# Altium project usb_keyboard.PrjPcb
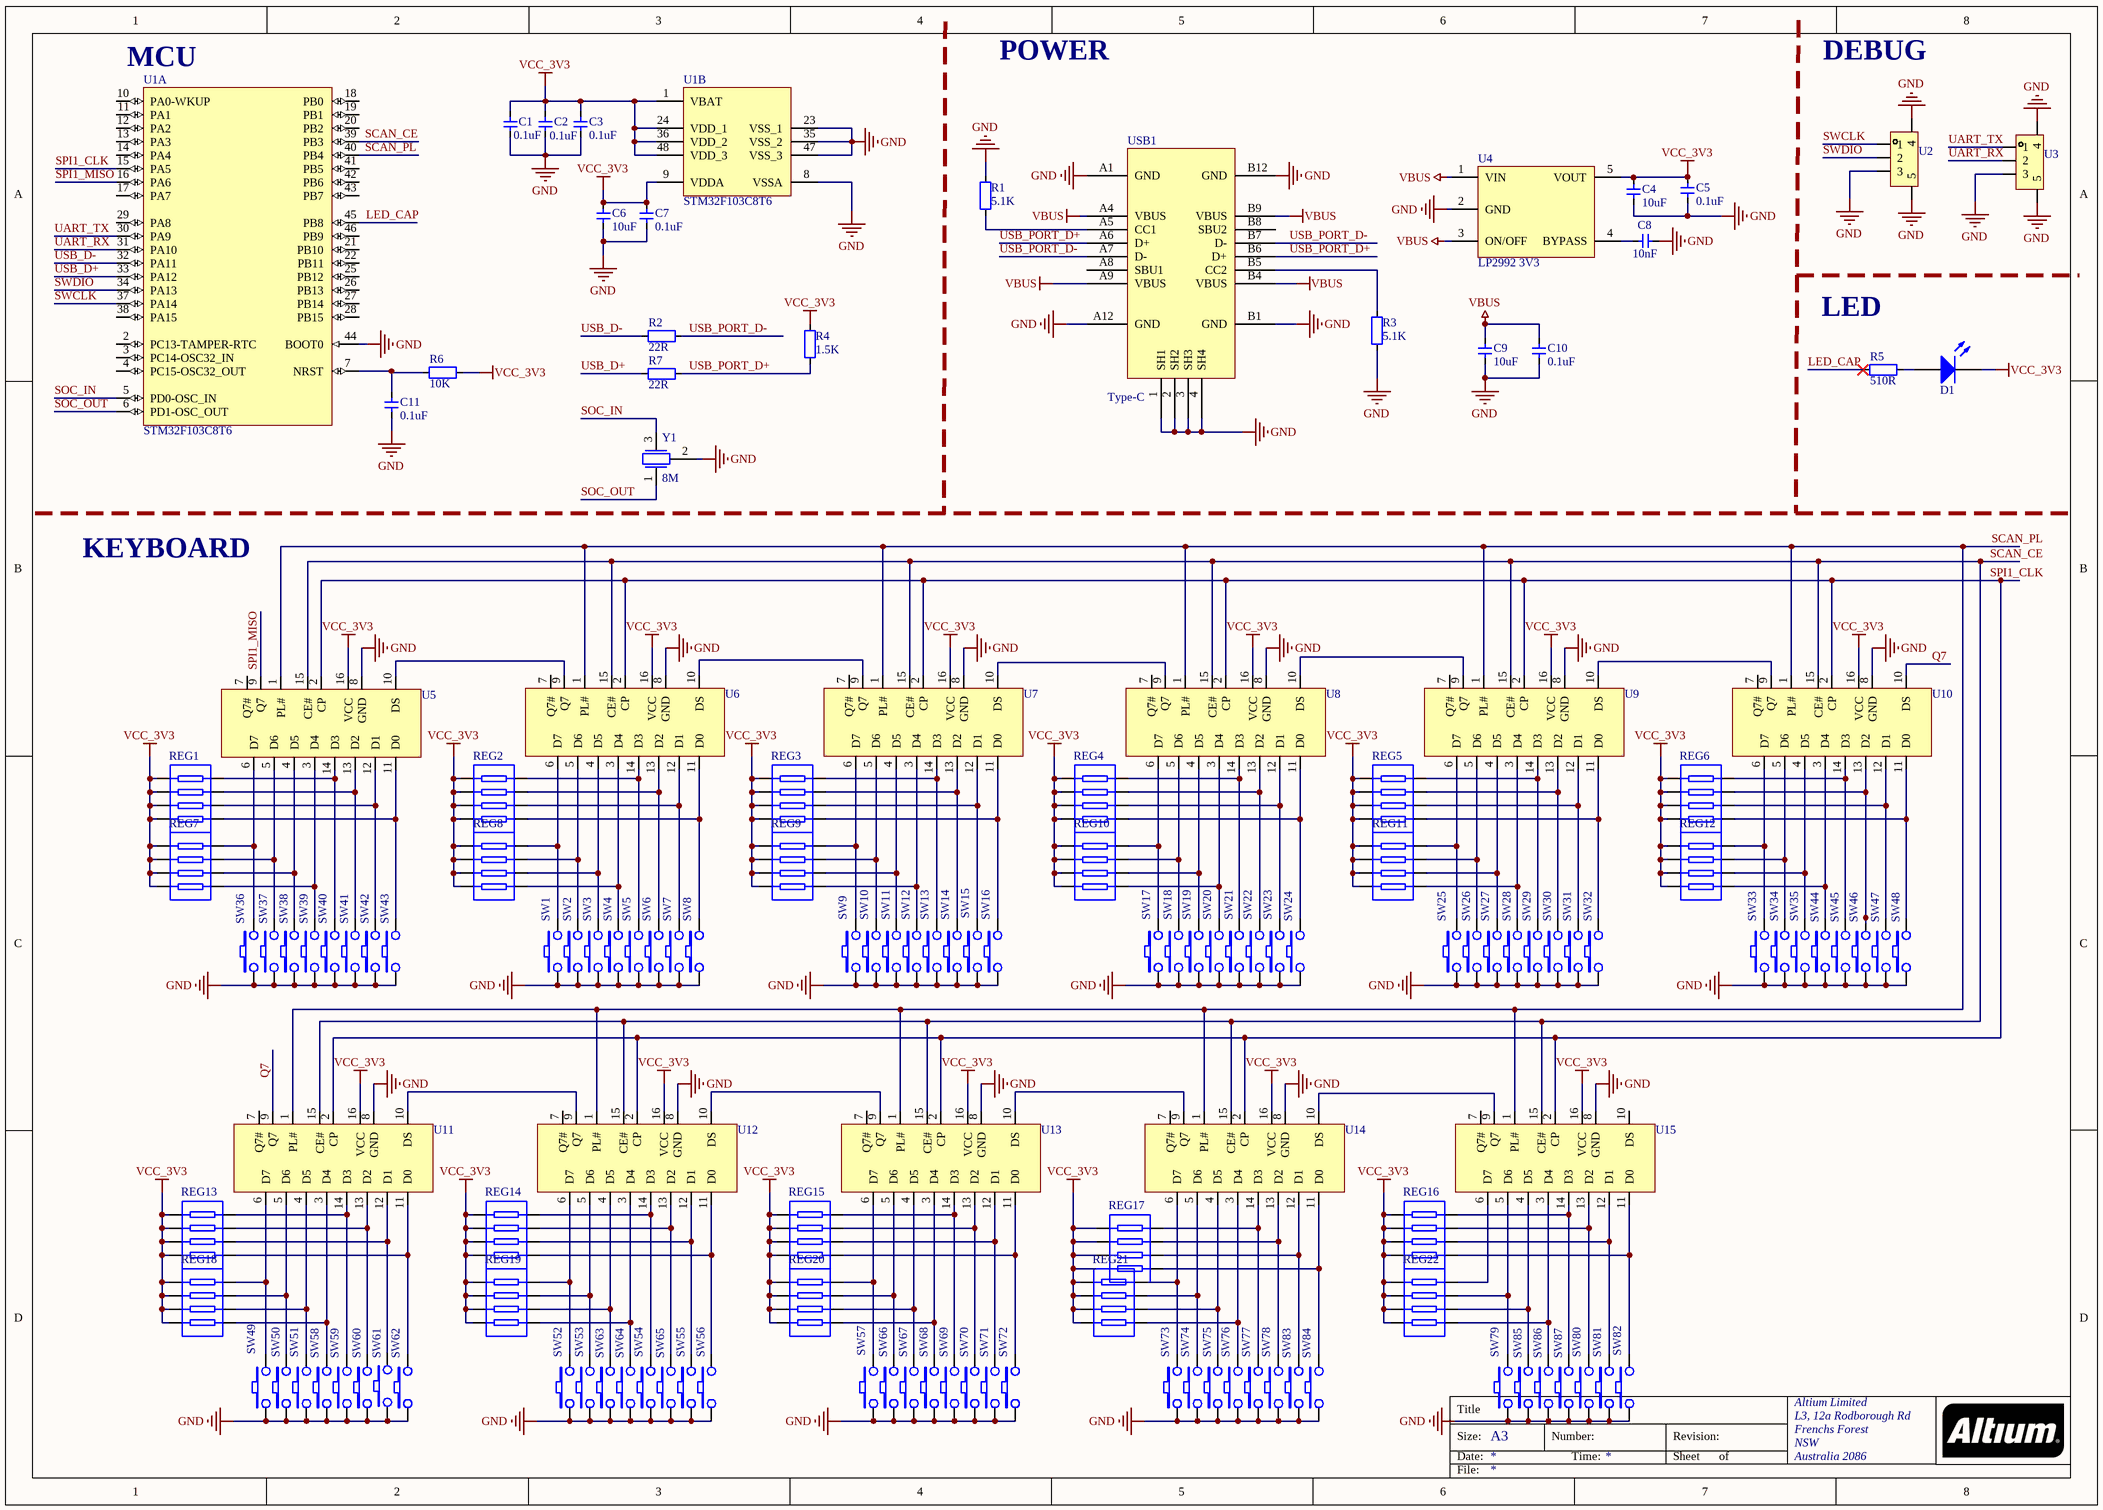
[diagram p0: usb_keyboard.SchDoc]
1 sheet, 145 parts. Net scope: global (net labels, ports and power ports of the same name join across sheets).
Board file: usb_keyboard.PcbDoc

## Sheet usb_keyboard.SchDoc
size A3; Organization: Altium Limited; Address1: L3, 12a Rodborough Rd; Address2: Frenchs Forest; Address3: NSW; Address4: Australia 2086

### Parts
C1  0.1uF  [CAP_0603]
C2  0.1uF  [CAP_0603]
C3  0.1uF  [CAP_0603]
C4  10uF  [CAP_0603]
C5  0.1uF  [CAP_0603]
C6  10uF  [CAP_0603]
C7  0.1uF  [CAP_0603]
C8  10nF  [CAP_0603]
C9  10uF  [CAP_0603]
C10  0.1uF  [CAP_0603]
C11  0.1uF  [CAP_0603]
D1  LED  [LED_0603]  (value not drawn)
R1  5.1K  [REG_0603]
R2  22R  [REG_0603]
R3  5.1K  [REG_0603]
R4  1.5K  [REG_0603]
R5  510R  [REG_0603]
R6  10K  [REG_0603]
R7  22R  [REG_0603]
REG1  4D03WGJ0103T5E  [RES-ARRAY-SMD_0603-8P-L3.2-W1.6-BL]  (value not drawn)
REG2  4D03WGJ0103T5E  [RES-ARRAY-SMD_0603-8P-L3.2-W1.6-BL]  (value not drawn)
REG3  4D03WGJ0103T5E  [RES-ARRAY-SMD_0603-8P-L3.2-W1.6-BL]  (value not drawn)
REG4  4D03WGJ0103T5E  [RES-ARRAY-SMD_0603-8P-L3.2-W1.6-BL]  (value not drawn)
REG5  4D03WGJ0103T5E  [RES-ARRAY-SMD_0603-8P-L3.2-W1.6-BL]  (value not drawn)
REG6  4D03WGJ0103T5E  [RES-ARRAY-SMD_0603-8P-L3.2-W1.6-BL]  (value not drawn)
REG7  4D03WGJ0103T5E  [RES-ARRAY-SMD_0603-8P-L3.2-W1.6-BL]  (value not drawn)
REG8  4D03WGJ0103T5E  [RES-ARRAY-SMD_0603-8P-L3.2-W1.6-BL]  (value not drawn)
REG9  4D03WGJ0103T5E  [RES-ARRAY-SMD_0603-8P-L3.2-W1.6-BL]  (value not drawn)
REG10  4D03WGJ0103T5E  [RES-ARRAY-SMD_0603-8P-L3.2-W1.6-BL]  (value not drawn)
REG11  4D03WGJ0103T5E  [RES-ARRAY-SMD_0603-8P-L3.2-W1.6-BL]  (value not drawn)
REG12  4D03WGJ0103T5E  [RES-ARRAY-SMD_0603-8P-L3.2-W1.6-BL]  (value not drawn)
REG13  4D03WGJ0103T5E  [RES-ARRAY-SMD_0603-8P-L3.2-W1.6-BL]  (value not drawn)
REG14  4D03WGJ0103T5E  [RES-ARRAY-SMD_0603-8P-L3.2-W1.6-BL]  (value not drawn)
REG15  4D03WGJ0103T5E  [RES-ARRAY-SMD_0603-8P-L3.2-W1.6-BL]  (value not drawn)
REG16  4D03WGJ0103T5E  [RES-ARRAY-SMD_0603-8P-L3.2-W1.6-BL]  (value not drawn)
REG17  4D03WGJ0103T5E  [RES-ARRAY-SMD_0603-8P-L3.2-W1.6-BL]  (value not drawn)
REG18  4D03WGJ0103T5E  [RES-ARRAY-SMD_0603-8P-L3.2-W1.6-BL]  (value not drawn)
REG19  4D03WGJ0103T5E  [RES-ARRAY-SMD_0603-8P-L3.2-W1.6-BL]  (value not drawn)
REG20  4D03WGJ0103T5E  [RES-ARRAY-SMD_0603-8P-L3.2-W1.6-BL]  (value not drawn)
REG21  4D03WGJ0103T5E  [RES-ARRAY-SMD_0603-8P-L3.2-W1.6-BL]  (value not drawn)
REG22  4D03WGJ0103T5E  [RES-ARRAY-SMD_0603-8P-L3.2-W1.6-BL]  (value not drawn)
SW1  SW  [KEY_Mechanical]  (value not drawn)
SW2  SW  [KEY_Mechanical]  (value not drawn)
SW3  SW  [KEY_Mechanical]  (value not drawn)
SW4  SW  [KEY_Mechanical]  (value not drawn)
SW5  SW  [KEY_Mechanical]  (value not drawn)
SW6  SW  [KEY_Mechanical]  (value not drawn)
SW7  SW  [KEY_Mechanical]  (value not drawn)
SW8  SW  [KEY_Mechanical]  (value not drawn)
SW9  SW  [KEY_Mechanical]  (value not drawn)
SW10  SW  [KEY_Mechanical]  (value not drawn)
SW11  SW  [KEY_Mechanical]  (value not drawn)
SW12  SW  [KEY_Mechanical]  (value not drawn)
SW13  SW  [KEY_Mechanical]  (value not drawn)
SW14  SW  [KEY_Mechanical]  (value not drawn)
SW15  SW  [KEY_Mechanical]  (value not drawn)
SW16  SW  [KEY_Mechanical]  (value not drawn)
SW17  SW  [KEY_Mechanical]  (value not drawn)
SW18  SW  [KEY_Mechanical]  (value not drawn)
SW19  SW  [KEY_Mechanical]  (value not drawn)
SW20  SW  [KEY_Mechanical]  (value not drawn)
SW21  SW  [KEY_Mechanical]  (value not drawn)
SW22  SW  [KEY_Mechanical]  (value not drawn)
SW23  SW  [KEY_Mechanical]  (value not drawn)
SW24  SW  [KEY_Mechanical]  (value not drawn)
SW25  SW  [KEY_Mechanical]  (value not drawn)
SW26  SW  [KEY_Mechanical]  (value not drawn)
SW27  SW  [KEY_Mechanical]  (value not drawn)
SW28  SW  [KEY_Mechanical]  (value not drawn)
SW29  SW  [KEY_Mechanical]  (value not drawn)
SW30  SW  [KEY_Mechanical]  (value not drawn)
SW31  SW  [KEY_Mechanical]  (value not drawn)
SW32  SW  [KEY_Mechanical]  (value not drawn)
SW33  SW  [KEY_Mechanical]  (value not drawn)
SW34  SW  [KEY_Mechanical]  (value not drawn)
SW35  SW  [KEY_Mechanical]  (value not drawn)
SW36  SW  [KEY_Mechanical]  (value not drawn)
SW37  SW  [KEY_Mechanical]  (value not drawn)
SW38  SW  [KEY_Mechanical]  (value not drawn)
SW39  SW  [KEY_Mechanical]  (value not drawn)
SW40  SW  [KEY_Mechanical]  (value not drawn)
SW41  SW  [KEY_Mechanical]  (value not drawn)
SW42  SW  [KEY_Mechanical]  (value not drawn)
SW43  SW  [KEY_Mechanical]  (value not drawn)
SW44  SW  [KEY_Mechanical]  (value not drawn)
SW45  SW  [KEY_Mechanical]  (value not drawn)
SW46  SW  [KEY_Mechanical]  (value not drawn)
SW47  SW  [KEY_Mechanical]  (value not drawn)
SW48  SW  [KEY_Mechanical]  (value not drawn)
SW49  SW  [KEY_Mechanical]  (value not drawn)
SW50  SW  [KEY_Mechanical]  (value not drawn)
SW51  SW  [KEY_Mechanical]  (value not drawn)
SW52  SW  [KEY_Mechanical]  (value not drawn)
SW53  SW  [KEY_Mechanical]  (value not drawn)
SW54  SW  [KEY_Mechanical]  (value not drawn)
SW55  SW  [KEY_Mechanical]  (value not drawn)
SW56  SW  [KEY_Mechanical]  (value not drawn)
SW57  SW  [KEY_Mechanical]  (value not drawn)
SW58  SW  [KEY_Mechanical]  (value not drawn)
SW59  SW  [KEY_Mechanical]  (value not drawn)
SW60  SW  [KEY_Mechanical]  (value not drawn)
SW61  SW  [KEY_Mechanical]  (value not drawn)
SW62  SW  [KEY_Mechanical]  (value not drawn)
SW63  SW  [KEY_Mechanical]  (value not drawn)
SW64  SW  [KEY_Mechanical]  (value not drawn)
SW65  SW  [KEY_Mechanical]  (value not drawn)
SW66  SW  [KEY_Mechanical]  (value not drawn)
SW67  SW  [KEY_Mechanical]  (value not drawn)
SW68  SW  [KEY_Mechanical]  (value not drawn)
SW69  SW  [KEY_Mechanical]  (value not drawn)
SW70  SW  [KEY_Mechanical]  (value not drawn)
SW71  SW  [KEY_Mechanical]  (value not drawn)
SW72  SW  [KEY_Mechanical]  (value not drawn)
SW73  SW  [KEY_Mechanical]  (value not drawn)
SW74  SW  [KEY_Mechanical]  (value not drawn)
SW75  SW  [KEY_Mechanical]  (value not drawn)
SW76  SW  [KEY_Mechanical]  (value not drawn)
SW77  SW  [KEY_Mechanical]  (value not drawn)
SW78  SW  [KEY_Mechanical]  (value not drawn)
SW79  SW  [KEY_Mechanical]  (value not drawn)
SW80  SW  [KEY_Mechanical]  (value not drawn)
SW81  SW  [KEY_Mechanical]  (value not drawn)
SW82  SW  [KEY_Mechanical]  (value not drawn)
SW83  SW  [KEY_Mechanical]  (value not drawn)
SW84  SW  [KEY_Mechanical]  (value not drawn)
SW85  SW  [KEY_Mechanical]  (value not drawn)
SW86  SW  [KEY_Mechanical]  (value not drawn)
SW87  SW  [KEY_Mechanical]  (value not drawn)
U1  STM32F103C8T6  [STM-LQFP48_L]  (parts A,B of 2)
U2  SH1.0-3P-STAND  [SH1.0-3P-STAND]  (value not drawn)
U3  SH1.0-3P-STAND  [SH1.0-3P-STAND]  (value not drawn)
U4  LP2992 3V3  [SOT23-5]
U5  74HC165D,653  [SOIC-16_L9.9-W3.9-P1.27-LS6.0-BL]  (value not drawn)
U6  74HC165D,653  [SOIC-16_L9.9-W3.9-P1.27-LS6.0-BL]  (value not drawn)
U7  74HC165D,653  [SOIC-16_L9.9-W3.9-P1.27-LS6.0-BL]  (value not drawn)
U8  74HC165D,653  [SOIC-16_L9.9-W3.9-P1.27-LS6.0-BL]  (value not drawn)
U9  74HC165D,653  [SOIC-16_L9.9-W3.9-P1.27-LS6.0-BL]  (value not drawn)
U10  74HC165D,653  [SOIC-16_L9.9-W3.9-P1.27-LS6.0-BL]  (value not drawn)
U11  74HC165D,653  [SOIC-16_L9.9-W3.9-P1.27-LS6.0-BL]  (value not drawn)
U12  74HC165D,653  [SOIC-16_L9.9-W3.9-P1.27-LS6.0-BL]  (value not drawn)
U13  74HC165D,653  [SOIC-16_L9.9-W3.9-P1.27-LS6.0-BL]  (value not drawn)
U14  74HC165D,653  [SOIC-16_L9.9-W3.9-P1.27-LS6.0-BL]  (value not drawn)
U15  74HC165D,653  [SOIC-16_L9.9-W3.9-P1.27-LS6.0-BL]  (value not drawn)
USB1  Type-C  [Type-C-TOP]
Y1  8M  [晶振-3P]

### Nets
GND: C1.1 C2.1 C3.1 C4.1 C5.1 C6.1 C7.1 C8.1 C9.1 C10.1 C11.2 R1.2 R3.1 SW1.1 SW2.1 SW3.1 SW4.1 SW5.1 SW6.1 SW7.1 SW8.1 SW9.1 SW10.1 SW11.1 SW12.1 SW13.1 SW14.1 SW15.1 SW16.1 SW17.1 SW18.1 SW19.1 SW20.1 SW21.1 SW22.1 SW23.1 SW24.1 SW25.1 SW26.1 SW27.1 SW28.1 SW29.1 SW30.1 SW31.1 SW32.1 SW33.1 SW34.1 SW35.1 SW36.1 SW37.1 SW38.1 SW39.1 SW40.1 SW41.1 SW42.1 SW43.1 SW44.1 SW45.1 SW46.1 SW47.1 SW48.1 SW49.1 SW50.1 SW51.1 SW52.1 SW53.1 SW54.1 SW55.1 SW56.1 SW57.1 SW58.1 SW59.1 SW60.1 SW61.1 SW62.1 SW63.1 SW64.1 SW65.1 SW66.1 SW67.1 SW68.1 SW69.1 SW70.1 SW71.1 SW72.1 SW73.1 SW74.1 SW75.1 SW76.1 SW77.1 SW78.1 SW79.1 SW80.1 SW81.1 SW82.1 SW83.1 SW84.1 SW85.1 SW86.1 SW87.1 U1.8(VSSA) U1.23(VSS_1) U1.35(VSS_2) U1.44(BOOT0) U1.47(VSS_3) U2.3 U2.4 U2.5 U3.3 U3.4 U3.5 U4.2(GND) U5.8(GND) U6.8(GND) U7.8(GND) U8.8(GND) U9.8(GND) U10.8(GND) U11.8(GND) U12.8(GND) U13.8(GND) U14.8(GND) U15.8(GND) USB1.1(SH1) USB1.2(SH2) USB1.3(SH3) USB1.4(SH4) USB1.A1(GND) USB1.A12(GND) USB1.B1(GND) USB1.B12(GND) Y1.2
VBUS: C9.2 C10.2 U4.1(VIN) U4.3(ON/OFF) USB1.A4(VBUS) USB1.A9(VBUS) USB1.B4(VBUS) USB1.B9(VBUS)
VCC_3V3: C1.2 C2.2 C3.2 C4.2 C5.2 C6.2 C7.2 D1.K R4.2 R6.2 REG1.1 REG1.2 REG1.3 REG1.4 REG2.1 REG2.2 REG2.3 REG2.4 REG3.1 REG3.2 REG3.3 REG3.4 REG4.1 REG4.2 REG4.3 REG4.4 REG5.1 REG5.2 REG5.3 REG5.4 REG6.1 REG6.2 REG6.3 REG6.4 REG7.1 REG7.2 REG7.3 REG7.4 REG8.1 REG8.2 REG8.3 REG8.4 REG9.1 REG9.2 REG9.3 REG9.4 REG10.1 REG10.2 REG10.3 REG10.4 REG11.1 REG11.2 REG11.3 REG11.4 REG12.1 REG12.2 REG12.3 REG12.4 REG13.1 REG13.2 REG13.3 REG13.4 REG14.1 REG14.2 REG14.3 REG14.4 REG15.1 REG15.2 REG15.3 REG15.4 REG16.1 REG16.2 REG16.3 REG16.4 REG17.1 REG17.2 REG17.3 REG17.4 REG18.1 REG18.2 REG18.3 REG18.4 REG19.1 REG19.2 REG19.3 REG19.4 REG20.1 REG20.2 REG20.3 REG20.4 REG21.1 REG21.2 REG21.3 REG21.4 REG22.1 REG22.2 REG22.3 REG22.4 U1.1(VBAT) U1.9(VDDA) U1.24(VDD_1) U1.36(VDD_2) U1.48(VDD_3) U4.5(VOUT) U5.16(VCC) U6.16(VCC) U7.16(VCC) U8.16(VCC) U9.16(VCC) U10.16(VCC) U11.16(VCC) U12.16(VCC) U13.16(VCC) U14.16(VCC) U15.16(VCC)
LED_CAP: R5.1 U1.45(PB8)
Q7: U10.10(DS) U11.9(Q7)
SCAN_CE: U1.39(PB3) U5.15(CE#) U6.15(CE#) U7.15(CE#) U8.15(CE#) U9.15(CE#) U10.15(CE#) U11.15(CE#) U12.15(CE#) U13.15(CE#) U14.15(CE#) U15.15(CE#)
SCAN_PL: U1.40(PB4) U5.1(PL#) U6.1(PL#) U7.1(PL#) U8.1(PL#) U9.1(PL#) U10.1(PL#) U11.1(PL#) U12.1(PL#) U13.1(PL#) U14.1(PL#) U15.1(PL#)
SOC_IN: U1.5(PD0-OSC_IN) Y1.3
SOC_OUT: U1.6(PD1-OSC_OUT) Y1.1
SPI1_CLK: U1.15(PA5) U5.2(CP) U6.2(CP) U7.2(CP) U8.2(CP) U9.2(CP) U10.2(CP) U11.2(CP) U12.2(CP) U13.2(CP) U14.2(CP) U15.2(CP)
SPI1_MISO: U1.16(PA6) U5.9(Q7)
SWCLK: U1.37(PA14) U2.1
SWDIO: U1.34(PA13) U2.2
UART_RX: U1.31(PA10) U3.2
UART_TX: U1.30(PA9) U3.1
USB_D+: R7.1 U1.33(PA12)
USB_D-: R2.1 U1.32(PA11)
USB_PORT_D+: R4.1 R7.2 USB1.A6(D+) USB1.B6(D+)
USB_PORT_D-: R2.2 USB1.A7(D-) USB1.B7(D-)
NetC8_2: C8.2 U4.4(BYPASS)
NetC11_1: C11.1 R6.1 U1.7(NRST)
NetD1_A: D1.A R5.2
NetR1_1: R1.1 USB1.A5(CC1)
NetR3_2: R3.2 USB1.B5(CC2)
NetREG1_5: REG1.5 SW40.2 U5.14(D3)
NetREG1_6: REG1.6 SW41.2 U5.13(D2)
NetREG1_7: REG1.7 SW42.2 U5.12(D1)
NetREG1_8: REG1.8 SW43.2 U5.11(D0)
NetREG2_5: REG2.5 SW5.2 U6.14(D3)
NetREG2_6: REG2.6 SW6.2 U6.13(D2)
NetREG2_7: REG2.7 SW7.2 U6.12(D1)
NetREG2_8: REG2.8 SW8.2 U6.11(D0)
NetREG3_5: REG3.5 SW13.2 U7.14(D3)
NetREG3_6: REG3.6 SW14.2 U7.13(D2)
NetREG3_7: REG3.7 SW15.2 U7.12(D1)
NetREG3_8: REG3.8 SW16.2 U7.11(D0)
NetREG4_5: REG4.5 SW21.2 U8.14(D3)
NetREG4_6: REG4.6 SW22.2 U8.13(D2)
NetREG4_7: REG4.7 SW23.2 U8.12(D1)
NetREG4_8: REG4.8 SW24.2 U8.11(D0)
NetREG5_5: REG5.5 SW29.2 U9.14(D3)
NetREG5_6: REG5.6 SW30.2 U9.13(D2)
NetREG5_7: REG5.7 SW31.2 U9.12(D1)
NetREG5_8: REG5.8 SW32.2 U9.11(D0)
NetREG6_5: REG6.5 SW45.2 U10.14(D3)
NetREG6_6: REG6.6 SW46.2 U10.13(D2)
NetREG6_7: REG6.7 SW47.2 U10.12(D1)
NetREG6_8: REG6.8 SW48.2 U10.11(D0)
NetREG7_5: REG7.5 SW36.2 U5.6(D7)
NetREG7_6: REG7.6 SW37.2 U5.5(D6)
NetREG7_7: REG7.7 SW38.2 U5.4(D5)
NetREG7_8: REG7.8 SW39.2 U5.3(D4)
NetREG8_5: REG8.5 SW1.2 U6.6(D7)
NetREG8_6: REG8.6 SW2.2 U6.5(D6)
NetREG8_7: REG8.7 SW3.2 U6.4(D5)
NetREG8_8: REG8.8 SW4.2 U6.3(D4)
NetREG9_5: REG9.5 SW9.2 U7.6(D7)
NetREG9_6: REG9.6 SW10.2 U7.5(D6)
NetREG9_7: REG9.7 SW11.2 U7.4(D5)
NetREG9_8: REG9.8 SW12.2 U7.3(D4)
NetREG10_5: REG10.5 SW17.2 U8.6(D7)
NetREG10_6: REG10.6 SW18.2 U8.5(D6)
NetREG10_7: REG10.7 SW19.2 U8.4(D5)
NetREG10_8: REG10.8 SW20.2 U8.3(D4)
NetREG11_5: REG11.5 SW25.2 U9.6(D7)
NetREG11_6: REG11.6 SW26.2 U9.5(D6)
NetREG11_7: REG11.7 SW27.2 U9.4(D5)
NetREG11_8: REG11.8 SW28.2 U9.3(D4)
NetREG12_5: REG12.5 SW33.2 U10.6(D7)
NetREG12_6: REG12.6 SW34.2 U10.5(D6)
NetREG12_7: REG12.7 SW35.2 U10.4(D5)
NetREG12_8: REG12.8 SW44.2 U10.3(D4)
NetREG13_5: REG13.5 SW59.2 U11.14(D3)
NetREG13_6: REG13.6 SW60.2 U11.13(D2)
NetREG13_7: REG13.7 SW61.2 U11.12(D1)
NetREG13_8: REG13.8 SW62.2 U11.11(D0)
NetREG14_5: REG14.5 SW54.2 U12.14(D3)
NetREG14_6: REG14.6 SW65.2 U12.13(D2)
NetREG14_7: REG14.7 SW55.2 U12.12(D1)
NetREG14_8: REG14.8 SW56.2 U12.11(D0)
NetREG15_5: REG15.5 SW69.2 U13.14(D3)
NetREG15_6: REG15.6 SW70.2 U13.13(D2)
NetREG15_7: REG15.7 SW71.2 U13.12(D1)
NetREG15_8: REG15.8 SW72.2 U13.11(D0)
NetREG16_5: REG16.5 SW87.2 U15.14(D3)
NetREG16_6: REG16.6 SW80.2 U15.13(D2)
NetREG16_7: REG16.7 SW81.2 U15.12(D1)
NetREG16_8: REG16.8 SW82.2 U15.11(D0)
NetREG17_5: REG17.5 SW77.2 U14.14(D3)
NetREG17_6: REG17.6 SW78.2 U14.13(D2)
NetREG17_7: REG17.7 SW83.2 U14.12(D1)
NetREG17_8: REG17.8 SW84.2 U14.11(D0)
NetREG18_5: REG18.5 SW49.2 U11.6(D7)
NetREG18_6: REG18.6 SW50.2 U11.5(D6)
NetREG18_7: REG18.7 SW51.2 U11.4(D5)
NetREG18_8: REG18.8 SW58.2 U11.3(D4)
NetREG19_5: REG19.5 SW52.2 U12.6(D7)
NetREG19_6: REG19.6 SW53.2 U12.5(D6)
NetREG19_7: REG19.7 SW63.2 U12.4(D5)
NetREG19_8: REG19.8 SW64.2 U12.3(D4)
NetREG20_5: REG20.5 SW57.2 U13.6(D7)
NetREG20_6: REG20.6 SW66.2 U13.5(D6)
NetREG20_7: REG20.7 SW67.2 U13.4(D5)
NetREG20_8: REG20.8 SW68.2 U13.3(D4)
NetREG21_5: REG21.5 SW73.2 U14.6(D7)
NetREG21_6: REG21.6 SW74.2 U14.5(D6)
NetREG21_7: REG21.7 SW75.2 U14.4(D5)
NetREG21_8: REG21.8 SW76.2 U14.3(D4)
NetREG22_5: REG22.5 U15.6(D7)
NetREG22_6: REG22.6 SW79.2 U15.5(D6)
NetREG22_7: REG22.7 SW85.2 U15.4(D5)
NetREG22_8: REG22.8 SW86.2 U15.3(D4)
NetU5_10: U5.10(DS) U6.9(Q7)
NetU6_10: U6.10(DS) U7.9(Q7)
NetU7_10: U7.10(DS) U8.9(Q7)
NetU8_10: U8.10(DS) U9.9(Q7)
NetU9_10: U9.10(DS) U10.9(Q7)
NetU11_10: U11.10(DS) U12.9(Q7)
NetU12_10: U12.10(DS) U13.9(Q7)
NetU13_10: U13.10(DS) U14.9(Q7)
NetU14_10: U14.10(DS) U15.9(Q7)

Not connected (* = marked no-connect by the designer): U1 2(PC13-TAMPER-RTC) 3(PC14-OSC32_IN) 4(PC15-OSC32_OUT) 10(PA0-WKUP) 11(PA1) 12(PA2) 13(PA3) 14(PA4) 17(PA7) 18(PB0) 19(PB1) 20(PB2) 21(PB10) 22(PB11) 25(PB12) 26(PB13) 27(PB14) 28(PB15) 29(PA8) 38(PA15) 41(PB5) 42(PB6) 43(PB7) 46(PB9); U5 7(Q7#); U6 7(Q7#); U7 7(Q7#); U8 7(Q7#); U9 7(Q7#); U10 7(Q7#); U11 7(Q7#); U12 7(Q7#); U13 7(Q7#); U14 7(Q7#); U15 7(Q7#) 10(DS); USB1 A8(SBU1) B8(SBU2)

### Notes on the sheet
- (near U1) MCU
- POWER
- DEBUG
- (near R5) LED
- KEYBOARD
- Title
- Size:
- Date:
- A3
- Number:
- Time:
- Revision:
- Sheet
- of
- File:

### Library data of the parts
C1-C11 = 电容: Capacitor; Value: 0.1u
D1 = LED: Typical INFRARED GaAs LED; Published: 8-Jun-2000; LatestRevisionDate: 08-Jul-2005; LatestRevisionNote: Mech Layer 1 removed.; PackageReference: LED-0; Publisher: Altium Limited; PackageDescription: LED; 2 Leads
R1 R3-R6 = 电阻: Resistor; Value: 22R
R2 R7 = 电阻: Resistor; Value: 22R
REG1-REG22 = 排阻: 阻值:10kΩ;精度:±5%;单个元件功率:62.5mW;温度系数:±200ppm/;电阻器数:4;引脚数:8;; Manufacturer: UNI-ROYAL(厚声); NAME: 8; Add into BOM: yes; Tolerance: ±5%; Power(Watts): 62.5mW; Number of Resistors: 4; Pin Type: IN; Symbol: 4D03WGJ0103T5E; Device: 4D03WGJ0103T5E; LCSC Part Name: 10kΩ ±5%; Supplier Part: C29718; Manufacturer Part: 4D03WGJ0103T5E; Supplier Footprint: 0603x4; Datasheet: https://atta.szlcsc.com/upload/public/pdf/source/20170615/1497511005633.pdf; Supplier: LCSC; Convert to PCB: yes; Temperature Coefficient: ±200ppm/; Number of Pins: 8; NUMBER: 8
SW1-SW87 = SW: NAME: 2; Symbol: KEYBOARD-SW; Convert to PCB: yes; Origin Footprint 2: MX-KEY; Device: KEYBOARD-SW; Add into BOM: yes; NUMBER: 2
U1 = STM32F103C8T6: ARM Cortex-M3 32-bit MCU, 64 KB Flash, 20 KB Internal RAM, 37 I/Os, 48-pin LQFP, -40 to 85 degC, Tray; A/D Converter: 2x12-bit (10 Channel); FLASH Size (Prog) (kB): 64; I/Os (High Current): 37; Internal RAM Size (kB): 20; Operating Frequency(F) (Processor speed) (MHz): 72; Supply Voltage(Vcc) min (V): 2; DatasheetVersion: Rev. 16; PackageVersion: Rev. 6, 06/2013; PackageReference: LQFP48; PackageDescription: 48-Pin Low Profile Quad Flat Package, 7 x 7 mm Body, 0.5 mm Pitch; Supplier 1: Digi-Key; Supplier Part Number 1: 497-6063-ND; Supplier 2: Farnell; Supplier Part Number 2: 1447637; Supplier 3: Newark; Supplier Part Number 3: 59M2182; Supplier 4: Newark; Supplier Part Number 4: 57P1222; Supplier 5: Mouser; Supplier Part Number 5: 511-STM32F103C8T6; Core: ARM Cortex-M3; Packing: Tray; Mounting Technology: Surface Mount; PartNumber: STM32F103C8T6; ComponentLink1Description: Manufacturer URL; ComponentLink1URL: http://www.st.com/web/en/home.html; ComponentLink2Description: Datasheet; ComponentLink2URL: http://www.st.com/st-web-ui/static/active/en/resource/technical/document/datasheet/CD00161566.pdf; ComponentLink3Description: Package Specification; ComponentLink3URL: http://www.st.com/st-web-ui/static/active/en/resource/technical/document/datasheet/DM00058181.pdf
U2 U3 = SH1.0-3P-STAND: Add into BOM: yes; Pin Type: IN; Symbol: SH1.0-3P-STAND; Device: SH1.0-3P-STAND; LCSC Part Name: SH1.0-3P-STAND; Supplier Part: C9900023785; Manufacturer Part: SH1.0-3P-STAND; Supplier Footprint: CONN-SMD-3P; Datasheet: https://atta.szlcsc.comnull; Supplier: LCSC; Convert to PCB: yes
U4 = LP2992: LDO
U5-U15 = 74HC165D,653: Manufacturer: Nexperia(安世); Add into BOM: yes; Pin Type: IN; Symbol: 74HC165D,653; Device: 74HC165D,653; LCSC Part Name: 74HC165D,653; Supplier Part: C5613; Manufacturer Part: 74HC165D,653; Supplier Footprint: SOIC-16_150mil; Datasheet: https://atta.szlcsc.com/upload/public/pdf/source/20160218/1457707760975.pdf; Supplier: LCSC; Convert to PCB: yes
USB1 = USB-Type-C-TOP
Y1 = 晶振-3Pin: 村田贴片